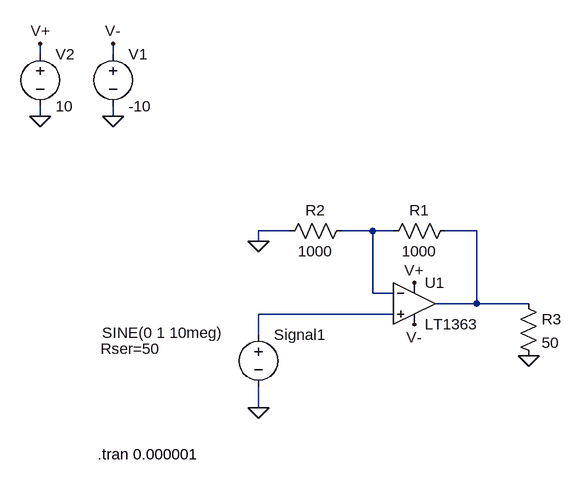
[diagram p0: schematic Amp_test.asc]
Amp_test.asc, the LTspice schematic file:
Version 4
SHEET 1 880 680
WIRE -656 -496 -656 -512
WIRE -544 -496 -544 -512
WIRE -656 -400 -656 -416
WIRE -544 -400 -544 -416
WIRE -272 -224 -320 -224
WIRE -144 -224 -192 -224
WIRE -112 -224 -144 -224
WIRE 16 -224 -32 -224
WIRE -320 -208 -320 -224
WIRE -144 -128 -144 -224
WIRE -112 -128 -144 -128
WIRE 16 -112 16 -224
WIRE 16 -112 -48 -112
WIRE 96 -112 16 -112
WIRE -112 -96 -320 -96
WIRE -320 -64 -320 -96
WIRE -320 48 -320 16
FLAG -320 48 0
FLAG -320 -208 0
FLAG -544 -400 0
FLAG 96 -32 0
FLAG -656 -400 0
FLAG -656 -512 V+
FLAG -544 -512 V-
FLAG -80 -144 V+
FLAG -80 -80 V-
SYMBOL voltage -320 -80 R0
WINDOW 3 -241 13 Left 2
WINDOW 123 0 0 Left 2
WINDOW 39 -243 37 Left 2
SYMATTR Value SINE(0 1 10meg)
SYMATTR SpiceLine Rser=50
SYMATTR InstName Signal1
SYMBOL res -16 -240 R90
WINDOW 0 0 56 VBottom 2
WINDOW 3 32 56 VTop 2
SYMATTR InstName R1
SYMATTR Value 1000
SYMBOL res -176 -240 R90
WINDOW 0 0 56 VBottom 2
WINDOW 3 32 56 VTop 2
SYMATTR InstName R2
SYMATTR Value 1000
SYMBOL voltage -544 -512 R0
WINDOW 123 0 0 Left 2
WINDOW 39 0 0 Left 2
SYMATTR InstName V1
SYMATTR Value -10
SYMBOL res 80 -128 R0
SYMATTR InstName R3
SYMATTR Value 50
SYMBOL voltage -656 -512 R0
WINDOW 123 0 0 Left 2
WINDOW 39 0 0 Left 2
SYMATTR InstName V2
SYMATTR Value 10
SYMBOL Opamps\\LT1363 -80 -176 R0
SYMATTR InstName U1
TEXT -568 120 Left 2 !.tran 0.000001

The netlist it stands for:
* Amp_test.asc
V§Signal1 N003 0 SINE(0 1 10meg) Rser=50
R1 N002 N001 1000
R2 N001 0 1000
V1 V- 0 -10
R3 N002 0 50
V2 V+ 0 10
XU1 N003 N001 V+ V- N002 LT1363  ; pins In+ In- V+ V- OUT
.tran 0.000001
.lib LT1363.sub
.backanno
.end